# EAGLE design Joystick Rev J (EAGLE 9.6.2)
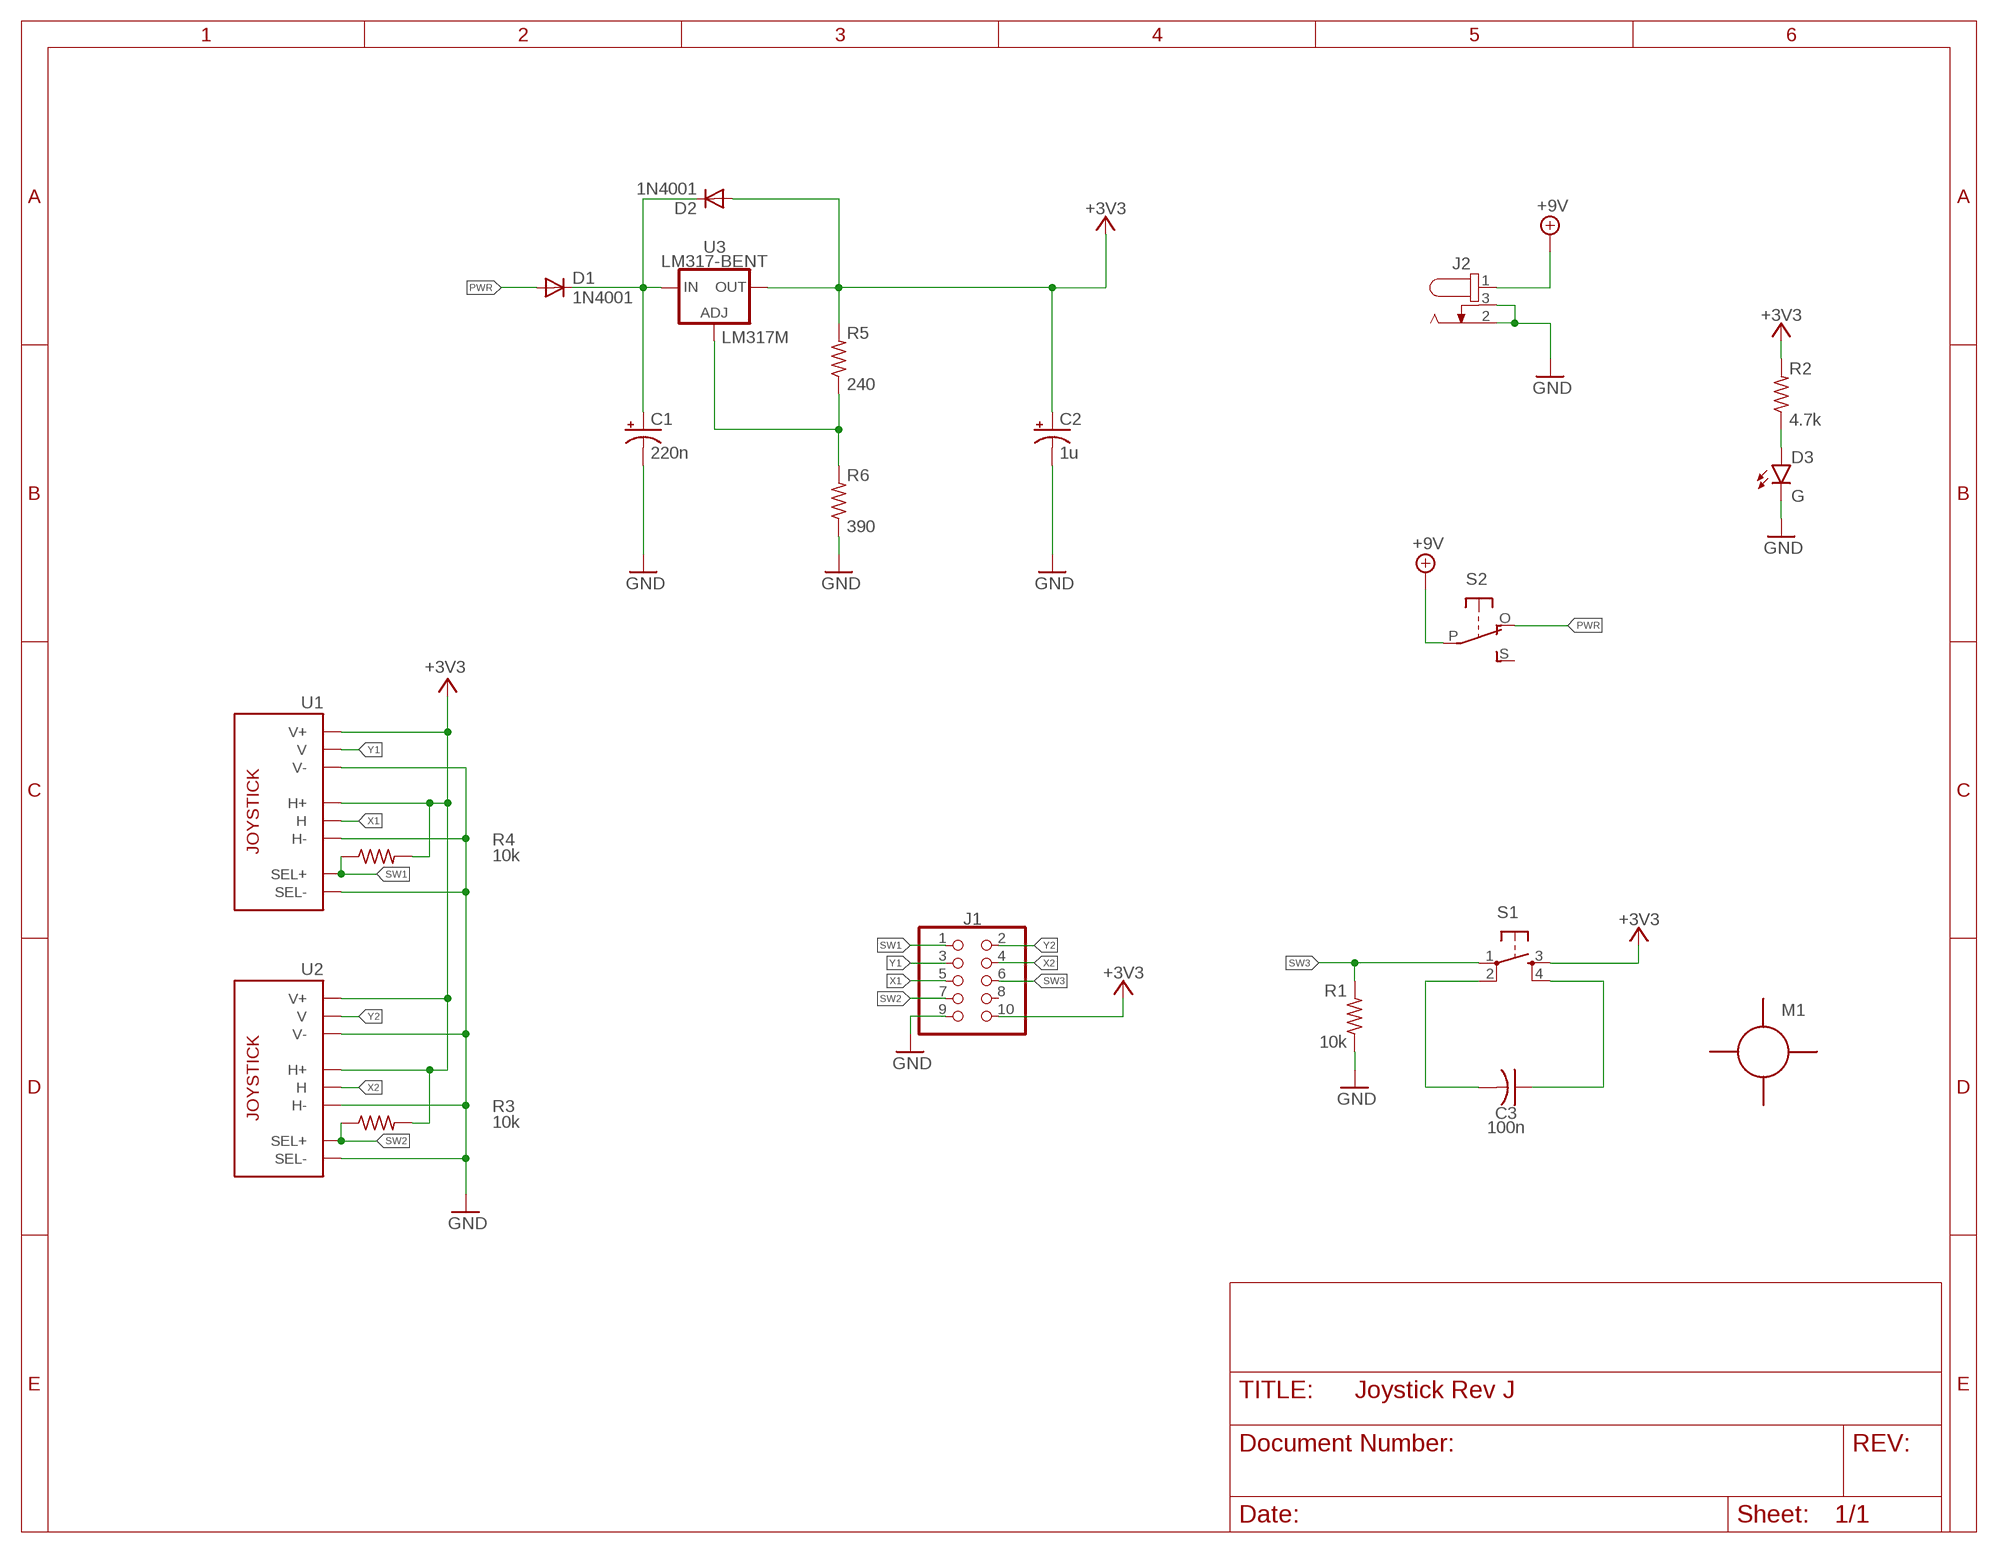
[diagram p0: schematic, sheet 1]

## Parts
C1  220n  ELECTROLYTIC-CAPACITOR2-4  [E2-4]
C2  1u  ELECTROLYTIC-CAPACITOR2-4  [E2-4]
C3  100n  THT-CER-CAPACITOR  [C050-024X044]
D1  1N4001  1N4000  [DO41-10]
D2  1N4001  1N4000  [DO41-10]
D3  G  LED  [LED5MM]
J1  RIBBON-2X5  [057-010-1]
J2  694106301002  [694106301002]
M1  9V-HOLDERM2.5  [9V-HOLDER-M2.5]
R1  10k  RESISTOR  [0207/10]
R2  4.7k  RESISTOR  [0207/10]
R3  10k  RESISTOR  [0207/10]
R4  10k  RESISTOR  [0207/10]
R5  240  RESISTOR  [0207/10]
R6  390  RESISTOR  [0207/10]
S1  TACTILE-BUTTON40XX  [B3F-40XX]
S2  SLIDE-SWITCHSIDE  [EG1270-90]
U1  JOYSTICK  [JOYSTICK]
U2  JOYSTICK  [JOYSTICK]
U3  LM317-BENT  LM317BENT  [T03B]

## Nets
+3V3: C2.+ D2.A J1.10 R2.2 R3.2 R4.2 R5.2 S1.3(S) U1.H1(H+) U1.V1(V+) U2.H1(H+) U2.V1(V+) U3.2(OUT)
+9V: J2.1 S2.P
GND: C1.- C2.- D3.K(C) J1.9 J2.2 J2.3 R1.1 R6.1 U1.B2A(SEL-) U1.H3(H-) U1.V3(V-) U2.B2A(SEL-) U2.H3(H-) U2.V3(V-)
N$1: R5.1 R6.2 U3.1(ADJ)
N$2: D3.A R2.1
N$3: C3.1 S1.4(S1)
N$4: C3.2 S1.2(P1)
N$5: C1.+ D1.C D2.C U3.3(IN)
PWR: D1.A S2.O
SW1: J1.1 R4.1 U1.B1A(SEL+)
SW2: J1.7 R3.1 U2.B1A(SEL+)
SW3: J1.6 R1.2 S1.1(P)
X1: J1.5 U1.H2(H)
X2: J1.4 U2.H2(H)
Y1: J1.3 U1.V2(V)
Y2: J1.2 U2.V2(V)
Unconnected: J1.8 S2.S

## Library data of the parts
C1 C2 = Quantum Projects:ELECTROLYTIC-CAPACITOR
C3 = Quantum Projects:THT-CER-CAPACITOR
D1 D2 = Quantum Projects:1N4000
D3 = Quantum Projects:LED
J1 = Quantum Projects:RIBBON-2X5
J2 = Wurth_Connectors_WR-DC:694106301002: WR-DC DC Power Jack Right Angled (6.4) KIND PROPERTIES Quality Class 5 000 Mating cycles Type Right Angled MATERIAL PROPERTIES Insulator Material PA66 Insulator Flammability Rating UL94 V-0 Color Black Contact Material Copper Alloy Contact Type Stamped Center Pin Plating Gold Center Pin Terminal Plating Tin Tip Spring Material Tin Shunt Terminal Plating Tin GENERAL INFORMATION Operating Temperature -40 up to +85 °C Compliance RoHS ELECTRICAL PROPERTIES IR 1 5 A Working Voltage 30 V (AC) Withstanding Voltage 500 V (AC) Contact Resistance 50 mΩ RISO 100 MΩ PACKAGING PROPERTIES Packaging Bag <https://katalog.we-online.com/media/images/v2/o59009v209%20Family_WR-DC_DC_Power_Jack_Right_Angled_THT_69410x301002.jpg> Details see: https://katalog.we-online.com/en/em/DC_RIGHT_ANGLED_6_4_69410X301002 Updated by Ella Wu 2019-11-01 2019(C) Wurth Elektronik; DATASHEET-URL: https://katalog.we-online.com/em/datasheet/694106301002.pdf; IR: 5A; MOUNT: THT; PART-NUMBER: 694106301002; TYPE: Right Angled; WORKING-VOLTAGE: 30V(AC)
M1 = Quantum Projects:9V-HOLDER
R1-R6 = Quantum Projects:RESISTOR
S1 = Quantum Projects:TACTILE-BUTTON; SPICEPREFIX: S
S2 = Quantum Projects:SLIDE-SWITCH
U1 U2 = Quantum Projects:JOYSTICK
U3 = Quantum Projects:LM317; PARTNUMBER: LM317M

## Board
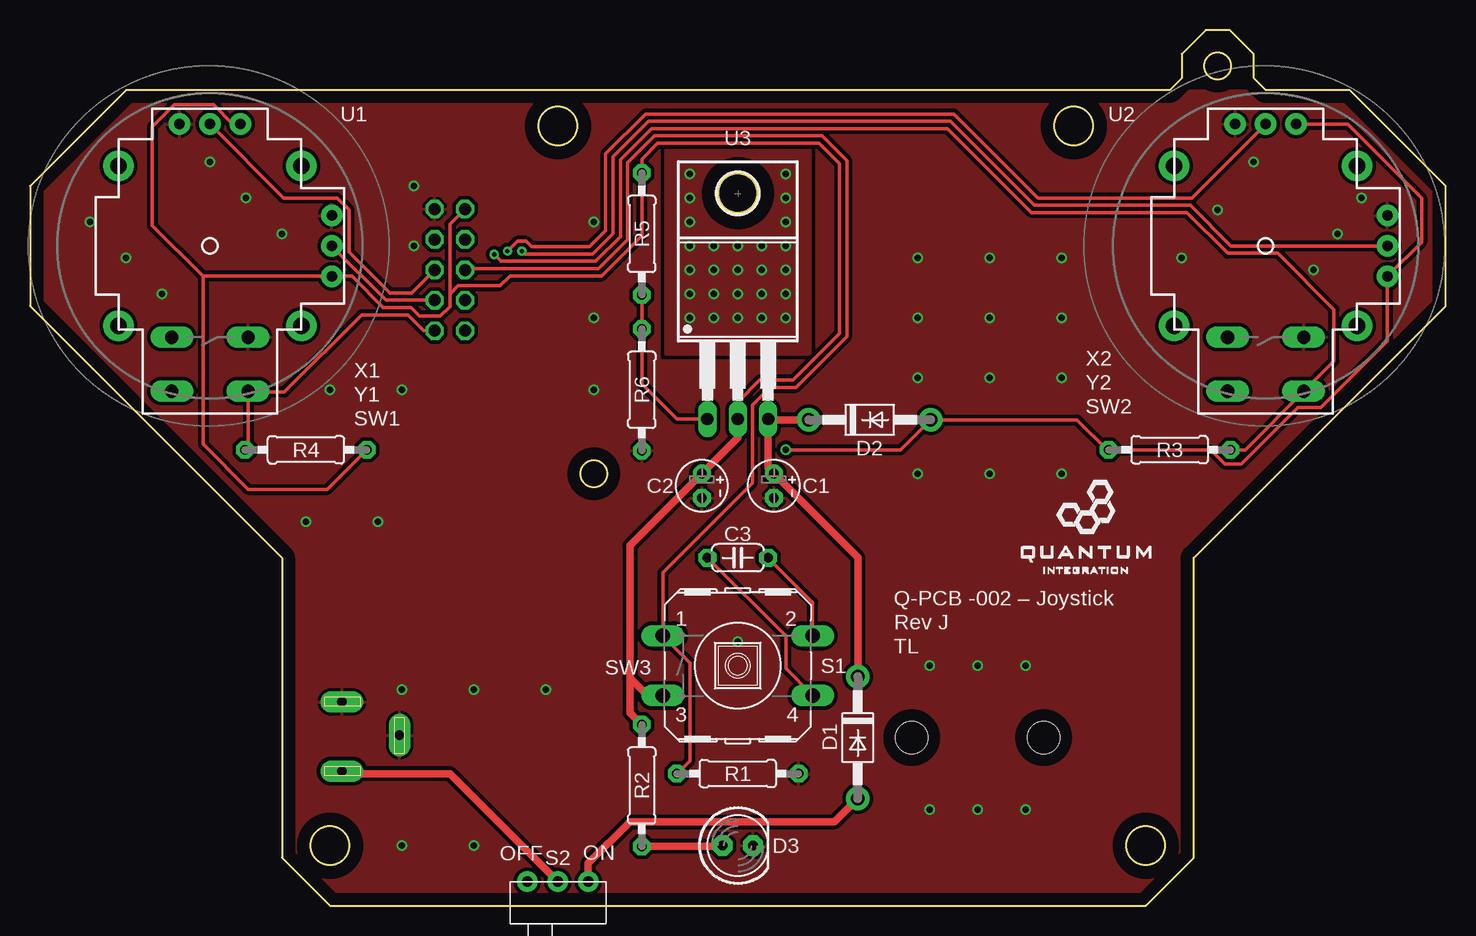
[diagram p1: board, top side]
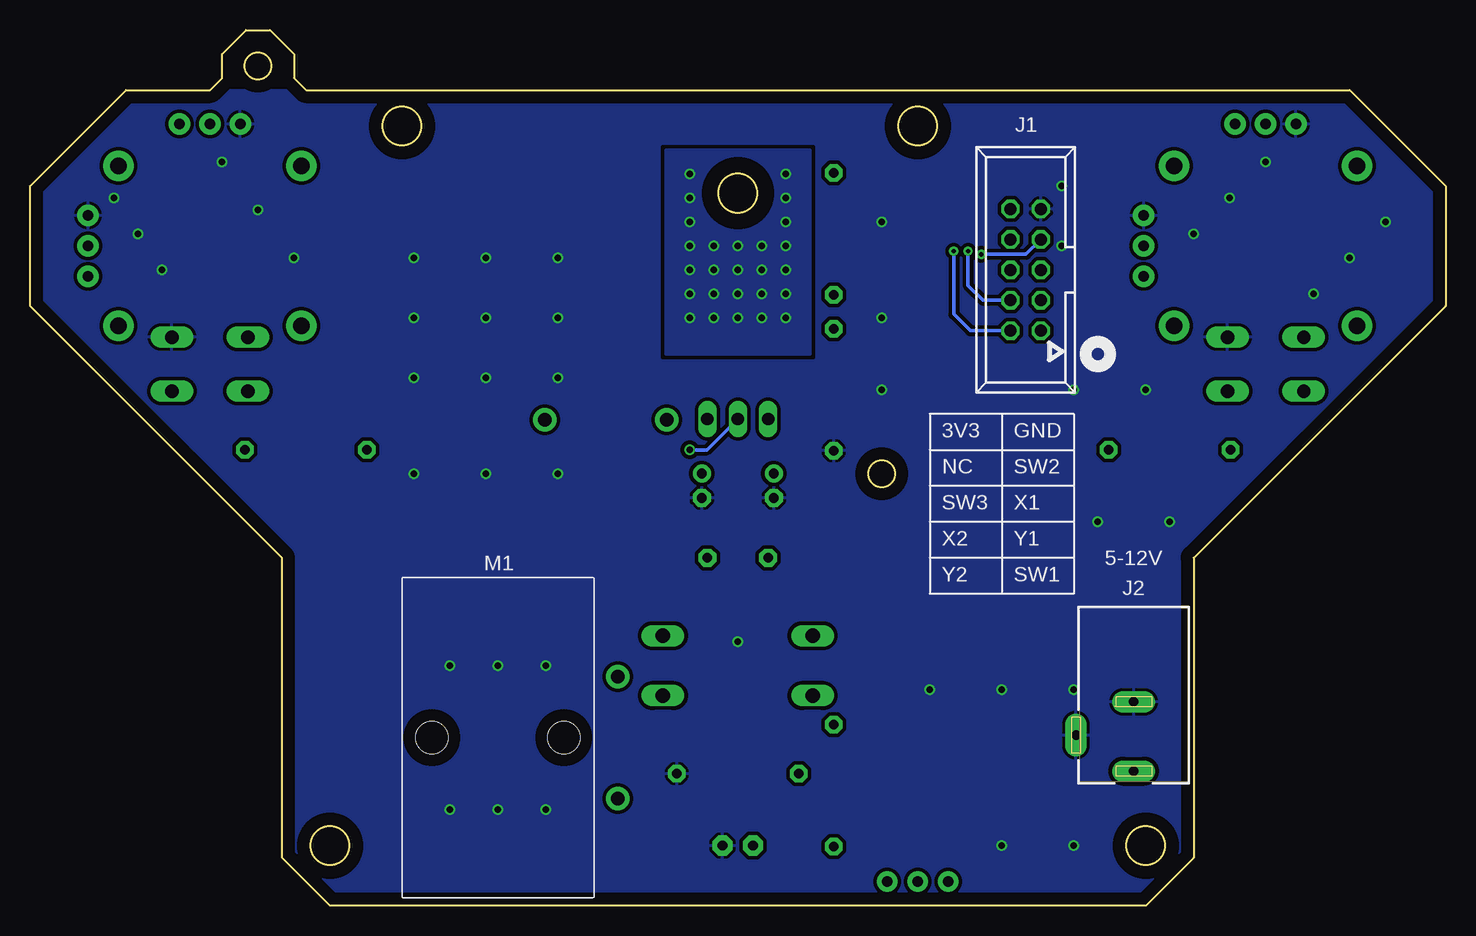
[diagram p2: board, bottom side, seen from below]

Size 118 x 73 mm. Coordinates in mm from the lower left corner, seen from the top.
Outline: 0,60 0,50 21,29 21,4 25,0 93,0 97,4 97,29 118,50 118,60 110,68 103,68 102,69 102,71 100,73 98,73 96,71 96,69 95,68 8,68 0,60
Outline: circle at 59,59.4 radius 1.62
Outline: circle at 87,65 radius 1.62
Outline: circle at 44,65 radius 1.62
Outline: circle at 93,5 radius 1.62
Outline: circle at 25,5 radius 1.62
Outline: circle at 47,36 radius 1.1
Outline: circle at 99,70 radius 1.1
Copper layers (1*16): Top 0.035mm / dielectric 1.5mm / Bottom 0.035mm
Design rules "quantum_projects": minimum track width 12mil, minimum drill 14mil, track to track 12mil, track to pad 12mil, pad to pad 12mil, via to via 12mil, smd to smd 10mil, copper to edge 40mil, drill to drill 10mil, minimum pad ring 10mil, minimum via ring 8mil, stop-mask expansion 4mil, vias tented up to drill 40mil, thermal gap 10mil
tRestrict: area 97,68 to 101,72; area 45,34 to 49,38; area 84.2,62.2 to 89.8,67.8; area 41.2,62.2 to 46.8,67.8; area 22.2,2.2 to 27.8,7.8; area 90.2,2.2 to 95.8,7.8; area 56,56.4 to 62,62.4
bRestrict: area 97,68 to 101,72; area 45,34 to 49,38; area 84.2,62.2 to 89.8,67.8; area 90.2,2.2 to 95.8,7.8; area 22.2,2.2 to 27.8,7.8; area 41.2,62.2 to 46.8,67.8; area 56,56.4 to 62,62.4

### Footprints (pad centres in the part's own frame; a part is rotated, then mirrored left to right if it is on the bottom)
E2-4 = drill 0.813 pad 1.5: + -1.016,0 | drill 0.813 pad 1.5 octagon: - 1.016,0
C050-024X044 = drill 0.813 pad 1.5 octagon: 1 -2.54,0; 2 2.54,0
DO41-10 = drill 1.118 pad 1.93: A 5.08,0; C -5.08,0
LED5MM = drill 0.813 pad 1.676 octagon: A -1.27,0; K 1.27,0
057-010-1 = drill 1 octagon: 1 -5.08,-1.27; 2 -5.08,1.27; 3 -2.54,-1.27; 4 -2.54,1.27; 5 0,-1.27; 6 0,1.27; 7 2.54,-1.27; 8 2.54,1.27; 9 5.08,-1.27; 10 5.08,1.27
694106301002 = drill 0.8 pad 1.8 long: 1 5.8,0; 2 0,0; 3 2.8,-4.8
9V-HOLDER-M2.5 = hole 2.7: 0,-5.5; 0,5.5
0207/10 = drill 0.813 pad 1.43 octagon: 1 -5.08,0; 2 5.08,0
B3F-40XX = drill 1.194 long: 1 -6.248,2.489; 2 6.248,2.489; 3 -6.248,-2.489; 4 6.248,-2.489
EG1270-90 = drill 0.9 pad 1.676: O -2.54,0; P 0,0; S 2.54,0
JOYSTICK = drill 1.1 pad 1.778 long: B1A -3.175,12.12; B1B 3.175,12.12; B2A -3.175,7.62; B2B 3.175,7.62 | drill 0.889 pad 1.778: H1 -2.54,-10.16; H2 0,-10.16; H3 2.54,-10.16; V1 -10.16,2.54; V2 -10.16,0; V3 -10.16,-2.54 | drill 1.397 pad 2.54: MOUNT1 -7.62,6.668; MOUNT2 -7.62,-6.668; MOUNT3 7.62,-6.668; MOUNT4 7.62,6.668
T03B = drill 1.016 long: 1 -2.54,-11.43; 2 0,-11.43; 3 2.54,-11.43

### Placement (x,y rotation side)
C1  62,35 270 top
C2  56,35 270 top
C3  59,29 0 top
D1  69,14 270 top
D2  70,40.5 0 top
D3  59,5 0 top
J1  35,53 90 bottom
J2  26,17 270 bottom
M1  79,14 270 bottom
R1  59,11 180 top
R2  51,10 90 top
R3  95,38 180 top
R4  23,38 0 top
R5  51,56 90 top
R6  51,43 90 top
S1  59,20 0 top
S2  44,2 180 top
U1  15,55 180 top
U2  103,55 180 top
U3  59,52 0 top

### Tracks (layer width: path | path; a pad name or v marks a point on that pad's centre or on a via)
+3V3  (via drill 0.51)
  Top 0.305: U2.H1 109.84,65.16 116,59 116,55.3 U2.V1 113.16,47.07 107.62,41.53 105.69,41.53 100.98,36.83 99.59,36.83 98.42,38 R3.2 89.84,37.92 87.26,40.5 D2.A 72.58,38 v63,38 | U1.H1 16.9,65.16 15.31,66.75 12,66.75 10.2,64.95 10.2,56.7 14.44,52.46 | 14.44,52.46 U1.V1 26.84,52.46 29.45,49.85 31.75,49.85 32.47,49.13 34.2,49.13 35,49.93 35,51 | 14.44,52.46 14.44,38.46 18.2,34.7 24.78,34.7 R4.2 | J1.10 35,56.81 35,51 | 35,51 35.7,51.7 39.2,51.7 40,52.5 47.66,52.5 51,55.84 R5.2 51,62.24 52.32,63.56 65.78,63.56 67.49,61.85 67.49,47.69 63.6,43.8 60.8,43.8 59,42 U3.2
  Top 0.635: R2.2 50,16.08 50,19 | 50,19 50,30.02 C2.+ 59,39.02 U3.2 | S1.3 51.49,17.51 50,19
  Bottom 0.305: v63,38 61.57,38 U3.2
+9V
  Top 0.635: S2.P 35,11 26.2,11 J2.1
GND  (via drill 0.51)
  other vias: 8,54 11,51 5,57 107,53 109,56 111,59 79,8 83,8 75,20 79,20 83,20 31,5 37,5 37,18 31,18 23,32 29,32 25,43 31,43 32,60 32,55 47,57 74,54 80,54 86,54 86,49 80,49 74,49 74,44 80,44 86,44 86,36 80,36 74,36 59,22 47,49 47,43 102,62 99,58 96,54 15,62 18,59 21,56 43,18 75,8
  pour Top (rank 3): 0,60 8,68 110,68 118,60 118,50 97,29 97,4 93,0 25,0 21,4 21,29 0,50
  pour Bottom (rank 3): 0,60 8,68 110,68 118,60 118,50 97,29 97,4 93,0 25,0 21,4 21,29 0,50
LM317-HS  (via drill 0.51)
  other vias: 55,57 55,59 55,61 63,61 63,59 63,57 63,55 61,55 59,55 57,55 55,55 55,53 55,51 55,49 57,49 57,51 57,53 59,53 59,51 59,49 61,49 61,51 61,53 63,53 63,51 63,49
  pour Bottom (no thermals): 53,63 65,63 65,46 53,46
  pour Top (no thermals): 53,63 65,63 65,46 53,46
N$1
  Top 0.305: U3.1 53.93,40.57 51,43.5 R6.2 R5.1
N$2
  Top 0.635: D3.A 57.65,4.92 R2.1
N$3
  Top 0.305: S1.4 63,19.76 63,22.46 C3.1
N$4
  Top 0.305: S1.2 65.25,25.29 C3.2
N$5
  Top 0.635: D1.C 69,29.02 C1.+ 61.54,36.48 U3.3 61.61,40.5 D2.C
PWR
  Top 0.635: S2.O 46.54,3.54 50,7 67.08,7 D1.A
SW1
  Top 0.305: U1.B1A 18.18,42.8 | 18.18,42.8 18.18,38.26 R4.1 | 18.18,42.8 21.2,42.8 27.64,49.24 31.5,49.24 32.82,47.92 J1.1
SW2  (via drill 0.36)
  Top 0.305: R3.1 101.3,38 U2.B1A 108.7,45.41 108.7,49.69 104,54.39 99.85,54.39 96.46,57.78 83.5,57.78 76.5,64.78 51.82,64.78 49.22,62.18 49.22,55.78 47.16,53.72 39.28,53.72 v38.7,54.3
  Bottom 0.305: v38.7,54.3 34.97,54.3 J1.7
SW3
  Top 0.305: R1.2 55,12.08 55,20.24 S1.1 52.75,27.75 60.22,35.22 60.22,41.73 61.67,43.19 63.85,43.19 68.1,47.44 68.1,62.1 66.03,64.17 52.07,64.17 49.83,61.93 49.83,55.53 47.41,53.11 36.38,53.11 J1.6
X1
  Top 0.305: U1.H2 21.16,59 25.6,59 26.51,58.1 26.51,58.09 26.6,58 26.6,54.5 30.03,51.07 31.8,51.07 J1.5
X2  (via drill 0.36)
  Top 0.305: U2.H2 96.84,59 84,59 77,66 51.31,66 48,62.69 48,56.28 46.65,54.94 41.8,54.94 41.35,55.4 40.64,55.4 v39.8,54.56
  Bottom 0.305: v39.8,54.56 39.8,51.7 38.56,50.46 J1.4
Y1
  Top 0.305: U1.V2 29.7,50.46 J1.3
Y2  (via drill 0.36)
  Top 0.305: U2.V2 100.1,55 96.71,58.39 83.75,58.39 76.75,65.39 51.57,65.39 48.61,62.43 48.61,56.03 46.91,54.33 41.23,54.33 v41,54.56
  Bottom 0.305: v41,54.56 41,49.3 39.62,47.92 J1.2

### Text on the board
tNames: X2 | X1 | Y2 | Y1 | SW2 | SW1 | Q-PCB -002 – Joystick | Rev J | SW3 | TL | OFF | ON
bNames: GND | 3V3 | SW2 | NC | X1 | SW3 | Y1 | X2 | 5-12V | SW1 | Y2